# Altium schematic sheet Sheet3.SchDoc
size A2
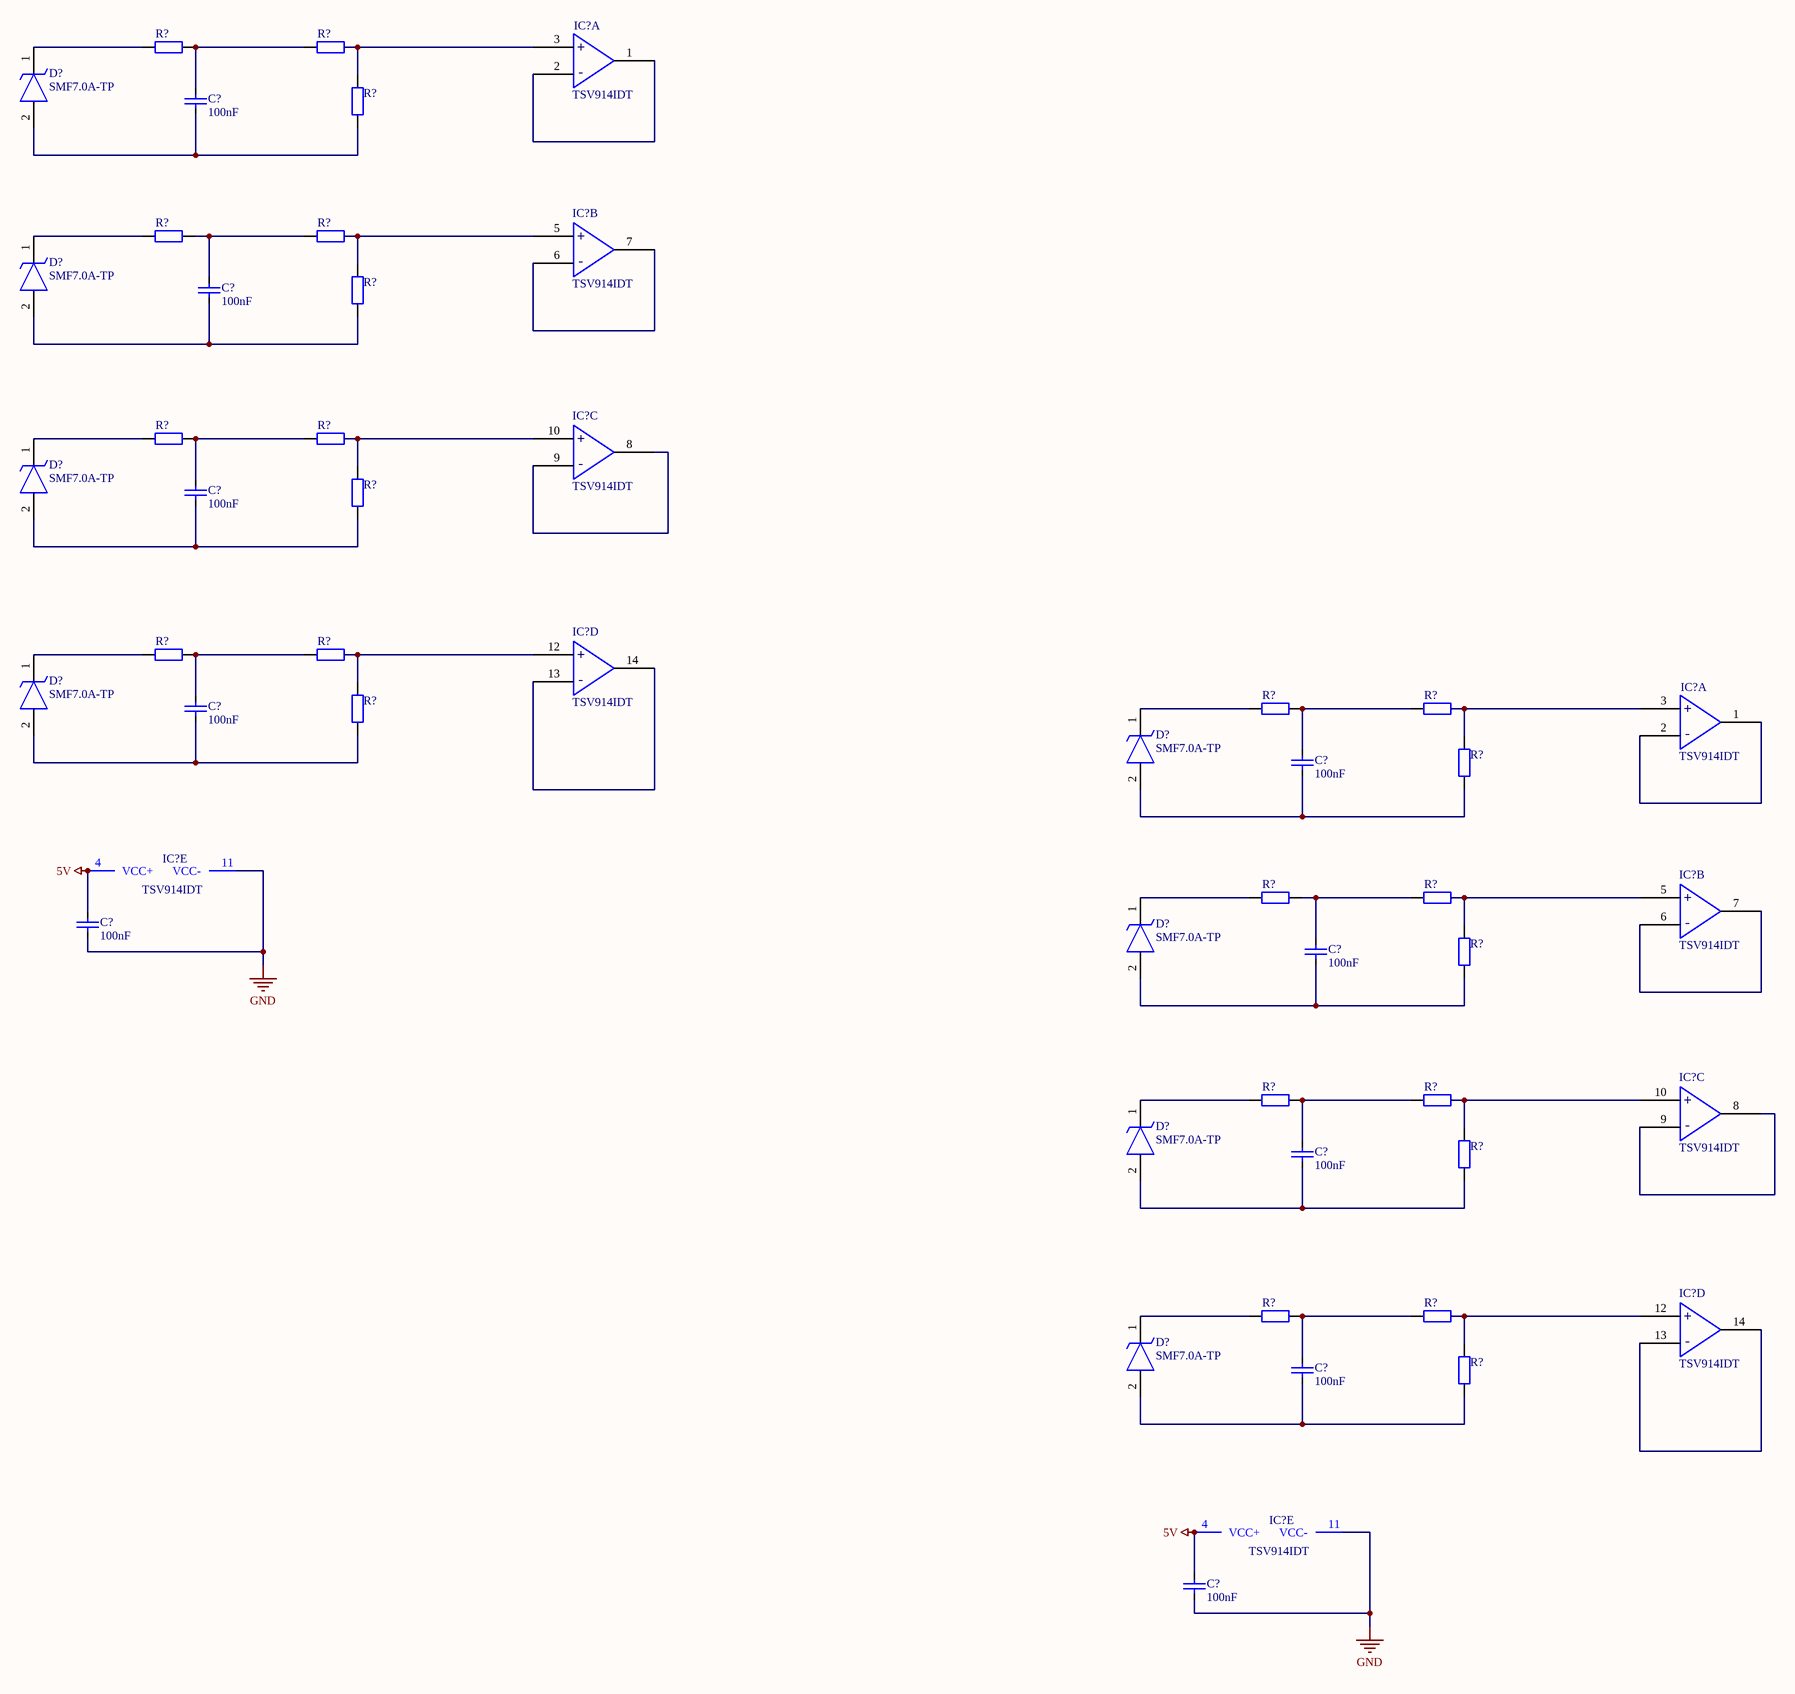
[diagram p0: Sheet3.SchDoc]

## Parts
(Parts that share a designator on the sheet are numbered #1, #2 ... from top to bottom, then left to right.)
C?#1  value 100nF  [CAPC1608X09N]  (hidden comment: C)
C?#2  value 100nF  [CAPC1608X09N]  (hidden comment: C)
C?#3  value 100nF  [CAPC1608X09N]  (hidden comment: C)
C?#4  value 100nF  [CAPC1608X09N]  (hidden comment: C)
C?#5  value 100nF  [CAPC1608X09N]  (hidden comment: C)
C?#6  value 100nF  [CAPC1608X09N]  (hidden comment: C)
C?#7  value 100nF  [CAPC1608X09N]  (hidden comment: C)
C?#8  value 100nF  [CAPC1608X09N]  (hidden comment: C)
C?#9  value 100nF  [CAPC1608X09N]  (hidden comment: C)
C?#10  value 100nF  [CAPC1608X09N]  (hidden comment: C)
D?#1  SMF7.0A-TP  [SMF70ATP]
D?#2  SMF7.0A-TP  [SMF70ATP]
D?#3  SMF7.0A-TP  [SMF70ATP]
D?#4  SMF7.0A-TP  [SMF70ATP]
D?#5  SMF7.0A-TP  [SMF70ATP]
D?#6  SMF7.0A-TP  [SMF70ATP]
D?#7  SMF7.0A-TP  [SMF70ATP]
D?#8  SMF7.0A-TP  [SMF70ATP]
IC?#1  TSV914IDT  [SOIC127P600X175-14N]  (part A of 5)
IC?#2  TSV914IDT  [SOIC127P600X175-14N]  (part B of 5)
IC?#3  TSV914IDT  [SOIC127P600X175-14N]  (part C of 5)
IC?#4  TSV914IDT  [SOIC127P600X175-14N]  (part D of 5)
IC?#5  TSV914IDT  [SOIC127P600X175-14N]  (part A of 5)
IC?#6  TSV914IDT  [SOIC127P600X175-14N]  (part E of 5)
IC?#7  TSV914IDT  [SOIC127P600X175-14N]  (part B of 5)
IC?#8  TSV914IDT  [SOIC127P600X175-14N]  (part C of 5)
IC?#9  TSV914IDT  [SOIC127P600X175-14N]  (part D of 5)
IC?#10  TSV914IDT  [SOIC127P600X175-14N]  (part E of 5)
R?#1  R  [RESC1608X06N]  (value not drawn)
R?#2  R  [RESC1608X06N]  (value not drawn)
R?#3  R  [RESC1608X06N]  (value not drawn)
R?#4  R  [RESC1608X06N]  (value not drawn)
R?#5  R  [RESC1608X06N]  (value not drawn)
R?#6  R  [RESC1608X06N]  (value not drawn)
R?#7  R  [RESC1608X06N]  (value not drawn)
R?#8  R  [RESC1608X06N]  (value not drawn)
R?#9  R  [RESC1608X06N]  (value not drawn)
R?#10  R  [RESC1608X06N]  (value not drawn)
R?#11  R  [RESC1608X06N]  (value not drawn)
R?#12  R  [RESC1608X06N]  (value not drawn)
R?#13  R  [RESC1608X06N]  (value not drawn)
R?#14  R  [RESC1608X06N]  (value not drawn)
R?#15  R  [RESC1608X06N]  (value not drawn)
R?#16  R  [RESC1608X06N]  (value not drawn)
R?#17  R  [RESC1608X06N]  (value not drawn)
R?#18  R  [RESC1608X06N]  (value not drawn)
R?#19  R  [RESC1608X06N]  (value not drawn)
R?#20  R  [RESC1608X06N]  (value not drawn)
R?#21  R  [RESC1608X06N]  (value not drawn)
R?#22  R  [RESC1608X06N]  (value not drawn)
R?#23  R  [RESC1608X06N]  (value not drawn)
R?#24  R  [RESC1608X06N]  (value not drawn)

## Nets
5V: C?#6.2 C?#10.2 IC?#6.4(VCC+) IC?#10.4(VCC+)
GND: C?#6.1 C?#10.1 IC?#6.11(VCC-) IC?#10.11(VCC-)
NetC?#1_1: C?#1.1 D?#1.2(A) R?#3.1
NetC?#1_2: C?#1.2 R?#1.1 R?#2.1
NetC?#2_1: C?#2.1 D?#2.2(A) R?#6.1
NetC?#2_2: C?#2.2 R?#4.1 R?#5.1
NetC?#3_1: C?#3.1 D?#3.2(A) R?#9.1
NetC?#3_2: C?#3.2 R?#7.1 R?#8.1
NetC?#4_1: C?#4.1 D?#4.2(A) R?#12.1
NetC?#4_2: C?#4.2 R?#10.1 R?#11.1
NetC?#5_1: C?#5.1 D?#5.2(A) R?#15.1
NetC?#5_2: C?#5.2 R?#13.1 R?#14.1
NetC?#7_1: C?#7.1 D?#6.2(A) R?#18.1
NetC?#7_2: C?#7.2 R?#16.1 R?#17.1
NetC?#8_1: C?#8.1 D?#7.2(A) R?#21.1
NetC?#8_2: C?#8.2 R?#19.1 R?#20.1
NetC?#9_1: C?#9.1 D?#8.2(A) R?#24.1
NetC?#9_2: C?#9.2 R?#22.1 R?#23.1
NetD?#1_1: D?#1.1(K) R?#1.2
NetD?#2_1: D?#2.1(K) R?#4.2
NetD?#3_1: D?#3.1(K) R?#7.2
NetD?#4_1: D?#4.1(K) R?#10.2
NetD?#5_1: D?#5.1(K) R?#13.2
NetD?#6_1: D?#6.1(K) R?#16.2
NetD?#7_1: D?#7.1(K) R?#19.2
NetD?#8_1: D?#8.1(K) R?#22.2
NetIC?#1_1: IC?#1.1(OUTA) IC?#1.2(IN-A)
NetIC?#1_3: IC?#1.3(In+A) R?#2.2 R?#3.2
NetIC?#2_5: IC?#2.5(In+B) R?#5.2 R?#6.2
NetIC?#2_6: IC?#2.6(IN-B) IC?#2.7(OUTB)
NetIC?#3_8: IC?#3.8(OUTC) IC?#3.9(IN-C)
NetIC?#3_10: IC?#3.10(In+C) R?#8.2 R?#9.2
NetIC?#4_12: IC?#4.12(In+D) R?#11.2 R?#12.2
NetIC?#4_13: IC?#4.13(IN-D) IC?#4.14(OUTD)
NetIC?#5_1: IC?#5.1(OUTA) IC?#5.2(IN-A)
NetIC?#5_3: IC?#5.3(In+A) R?#14.2 R?#15.2
NetIC?#7_5: IC?#7.5(In+B) R?#17.2 R?#18.2
NetIC?#7_6: IC?#7.6(IN-B) IC?#7.7(OUTB)
NetIC?#8_8: IC?#8.8(OUTC) IC?#8.9(IN-C)
NetIC?#8_10: IC?#8.10(In+C) R?#20.2 R?#21.2
NetIC?#9_12: IC?#9.12(In+D) R?#23.2 R?#24.2
NetIC?#9_13: IC?#9.13(IN-D) IC?#9.14(OUTD)

## Notes on the sheet
- (in symbol TSV914IDT, part A) +; -
- (in symbol TSV914IDT, part B) +; -
- (in symbol TSV914IDT, part C) +; -
- (in symbol TSV914IDT, part D) +; -

## Library data of the parts
C?#1-C?#10 = C: MPN: 06033C104KAT4A; Link: https://www.lcsc.com/product-detail/Multilayer-Ceramic-Capacitors-MLCC-SMD-SMT_Kyocera-AVX-06033C104KAT4A_C2167104.html
D?#1-D?#8 = SMF7.0A-TP: TVS Diode (Uni-directional); Manufacturer_Name: MCC; Manufacturer_Part_Number: FTR SMF7.0A; Datasheet Link: https://www.mccsemi.com/pdf/Products/SMF5.0-170(SOD-123FL).pdf; Height: 1.35mm; Arrow Part Number: SMF7.0A-TP; Arrow Price/Stock: https://www.arrow.com/en/products/smf7.0a-tp/micro-commercial-components; link: https://www.lcsc.com/product-detail/ESD-and-Surge-Protection-TVS-ESD_FTR-SMF7-0A_C707468.html
IC?#1-IC?#10 = TSV914IDT: Integrated Circuit; Manufacturer_Name: STMicroelectronics; Datasheet Link: http://www.st.com/st-web-ui/static/active/en/resource/technical/document/datasheet/CD00127596.pdf; Height: 1.75mm; Manufacturer_Part_Number: TSV914IDT; Mouser Part Number: 511-TSV914IDT; Mouser Price/Stock: https://www.mouser.co.uk/ProductDetail/STMicroelectronics/TSV914IDT?qs=5J552fbOmooMkhgQYeD%252Bdg%3D%3D; Arrow Part Number: TSV914IDT; Arrow Price/Stock: https://www.arrow.com/en/products/tsv914idt/stmicroelectronics